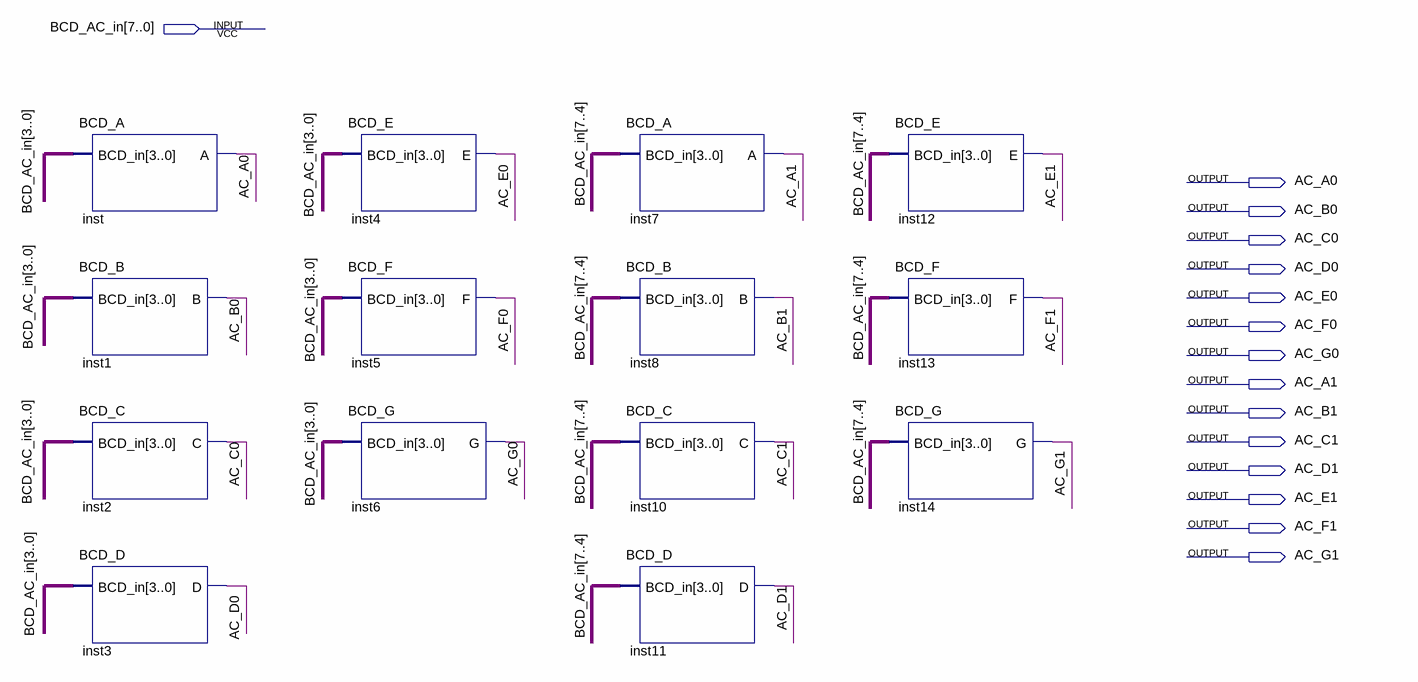
[diagram p0: schematic sheet]
// Quartus schematic BCD_AC.bdf as structural Verilog: 14 symbols, 15 pins
module BCD_AC (
  input  [7:0] BCD_AC_in,
  output AC_A0,
  output AC_B0,
  output AC_C0,
  output AC_D0,
  output AC_E0,
  output AC_F0,
  output AC_G0,
  output AC_A1,
  output AC_B1,
  output AC_C1,
  output AC_D1,
  output AC_E1,
  output AC_F1,
  output AC_G1
);

  BCD_A inst (.BCD_in(BCD_AC_in[3:0]), .A(AC_A0));
  BCD_B inst1 (.BCD_in(BCD_AC_in[3:0]), .B(AC_B0));
  BCD_C inst2 (.BCD_in(BCD_AC_in[3:0]), .C(AC_C0));
  BCD_D inst3 (.BCD_in(BCD_AC_in[3:0]), .D(AC_D0));
  BCD_E inst4 (.BCD_in(BCD_AC_in[3:0]), .E(AC_E0));
  BCD_F inst5 (.BCD_in(BCD_AC_in[3:0]), .F(AC_F0));
  BCD_G inst6 (.BCD_in(BCD_AC_in[3:0]), .G(AC_G0));
  BCD_A inst7 (.BCD_in(BCD_AC_in[7:4]), .A(AC_A1));
  BCD_B inst8 (.BCD_in(BCD_AC_in[7:4]), .B(AC_B1));
  BCD_C inst10 (.BCD_in(BCD_AC_in[7:4]), .C(AC_C1));
  BCD_D inst11 (.BCD_in(BCD_AC_in[7:4]), .D(AC_D1));
  BCD_E inst12 (.BCD_in(BCD_AC_in[7:4]), .E(AC_E1));
  BCD_F inst13 (.BCD_in(BCD_AC_in[7:4]), .F(AC_F1));
  BCD_G inst14 (.BCD_in(BCD_AC_in[7:4]), .G(AC_G1));
endmodule
